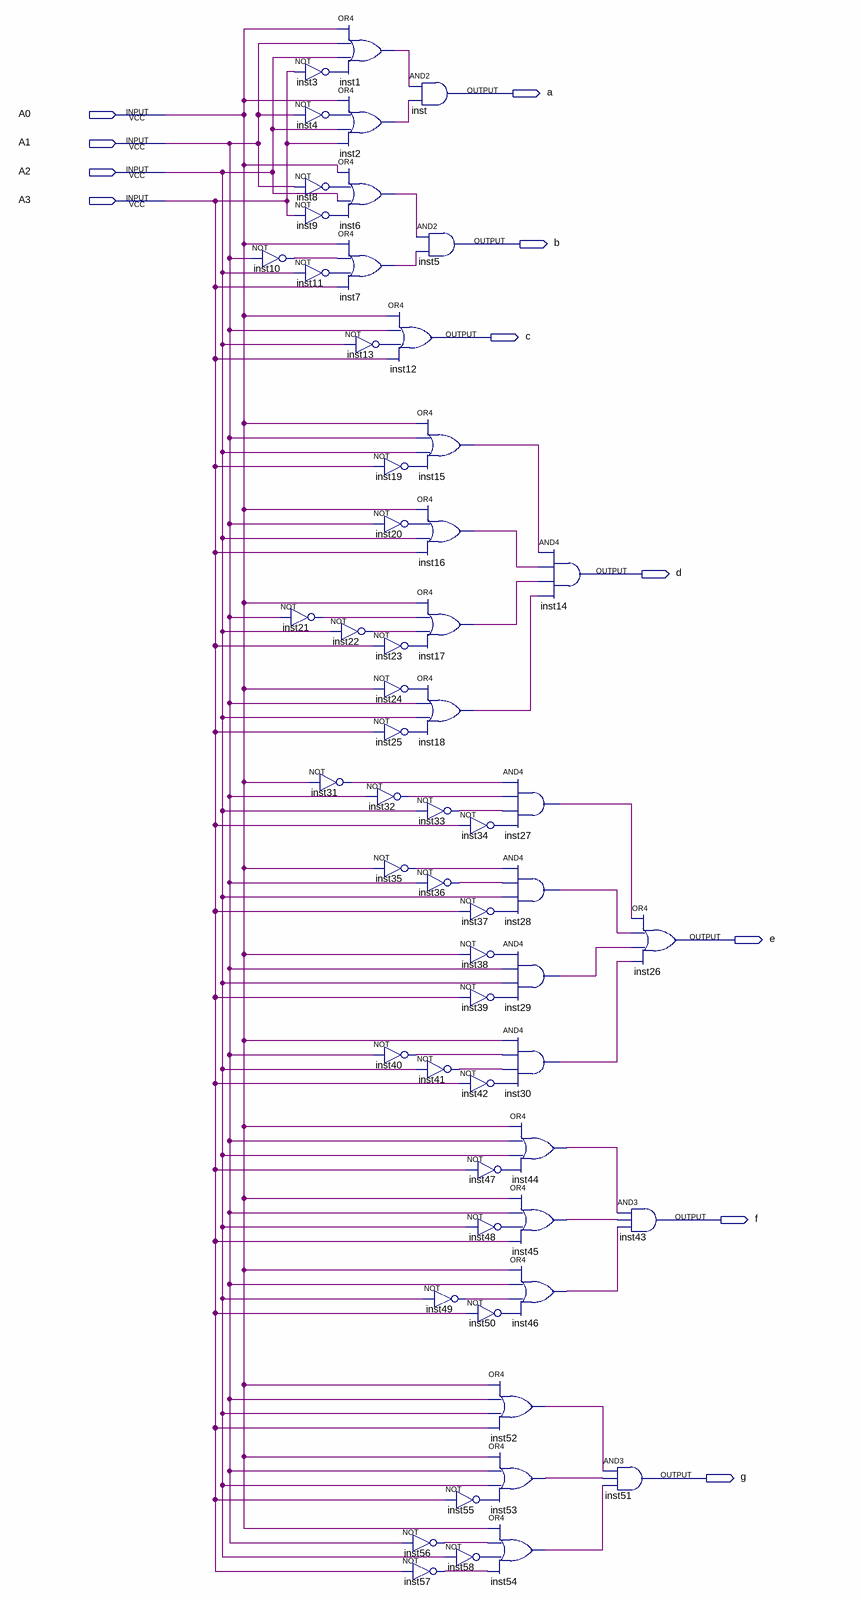
[diagram p0: schematic sheet]
// Quartus schematic coder.bdf as structural Verilog: 59 symbols, 11 pins
module coder (
  input  A0,
  input  A1,
  input  A2,
  input  A3,
  output a,
  output b,
  output c,
  output d,
  output e,
  output f,
  output g
);

  wire inst1_out, inst2_out, inst3_out, inst4_out, inst6_out, inst7_out, inst8_out, inst9_out, inst10_out,
       inst11_out, inst13_out, inst15_out, inst16_out, inst17_out, inst18_out, inst19_out, inst20_out,
       inst21_out, inst22_out, inst23_out, inst24_out, inst25_out, inst27_out, inst28_out, inst29_out,
       inst30_out, inst31_out, inst32_out, inst33_out, inst34_out, inst35_out, inst36_out, inst37_out,
       inst38_out, inst39_out, inst40_out, inst41_out, inst42_out, inst44_out, inst45_out, inst46_out,
       inst47_out, inst48_out, inst49_out, inst50_out, inst52_out, inst53_out, inst54_out, inst55_out,
       inst56_out, inst57_out, inst58_out;

  not inst3 (inst3_out, A3);
  not inst4 (inst4_out, A1);
  not inst8 (inst8_out, A1);
  not inst9 (inst9_out, A3);
  not inst10 (inst10_out, A1);
  not inst11 (inst11_out, A2);
  not inst21 (inst21_out, A1);
  or inst1 (inst1_out, A0, A1, A2, inst3_out);
  or inst2 (inst2_out, A0, inst4_out, A2, A3);
  or inst6 (inst6_out, A0, inst8_out, A2, inst9_out);
  or inst7 (inst7_out, A0, inst10_out, inst11_out, A3);
  not inst13 (inst13_out, A2);
  not inst22 (inst22_out, A2);
  not inst31 (inst31_out, A0);
  and inst (a, inst1_out, inst2_out);
  or inst12 (c, A0, A1, inst13_out, A3);
  not inst19 (inst19_out, A3);
  not inst20 (inst20_out, A1);
  not inst23 (inst23_out, A3);
  not inst24 (inst24_out, A0);
  not inst25 (inst25_out, A3);
  not inst32 (inst32_out, A1);
  not inst35 (inst35_out, A0);
  not inst40 (inst40_out, A1);
  not inst56 (inst56_out, A1);
  not inst57 (inst57_out, A3);
  and inst5 (b, inst6_out, inst7_out);
  or inst15 (inst15_out, A0, A1, A2, inst19_out);
  or inst16 (inst16_out, A0, inst20_out, A2, A3);
  or inst17 (inst17_out, A0, inst21_out, inst22_out, inst23_out);
  or inst18 (inst18_out, inst24_out, A1, A2, inst25_out);
  not inst33 (inst33_out, A2);
  not inst34 (inst34_out, A3);
  not inst36 (inst36_out, A1);
  not inst37 (inst37_out, A3);
  not inst38 (inst38_out, A0);
  not inst39 (inst39_out, A3);
  not inst41 (inst41_out, A2);
  not inst42 (inst42_out, A3);
  not inst47 (inst47_out, A3);
  not inst48 (inst48_out, A2);
  not inst49 (inst49_out, A2);
  not inst50 (inst50_out, A3);
  not inst55 (inst55_out, A3);
  not inst58 (inst58_out, A2);
  and inst27 (inst27_out, inst31_out, inst32_out, inst33_out, inst34_out);
  and inst28 (inst28_out, inst35_out, inst36_out, A2, inst37_out);
  and inst29 (inst29_out, inst38_out, A1, A2, inst39_out);
  and inst30 (inst30_out, A0, inst40_out, inst41_out, inst42_out);
  or inst44 (inst44_out, A0, A1, A2, inst47_out);
  or inst45 (inst45_out, A0, A1, inst48_out, A3);
  or inst46 (inst46_out, A0, A1, inst49_out, inst50_out);
  or inst52 (inst52_out, A0, A1, A2, A3);
  or inst53 (inst53_out, A0, A1, A2, inst55_out);
  or inst54 (inst54_out, A0, inst56_out, inst58_out, inst57_out);
  and inst14 (d, inst15_out, inst16_out, inst17_out, inst18_out);
  or inst26 (e, inst27_out, inst28_out, inst29_out, inst30_out);
  and inst43 (f, inst44_out, inst45_out, inst46_out);
  and inst51 (g, inst52_out, inst53_out, inst54_out);
endmodule
